# Altium schematic sheet Ganhuangguan.SchDoc
size A4
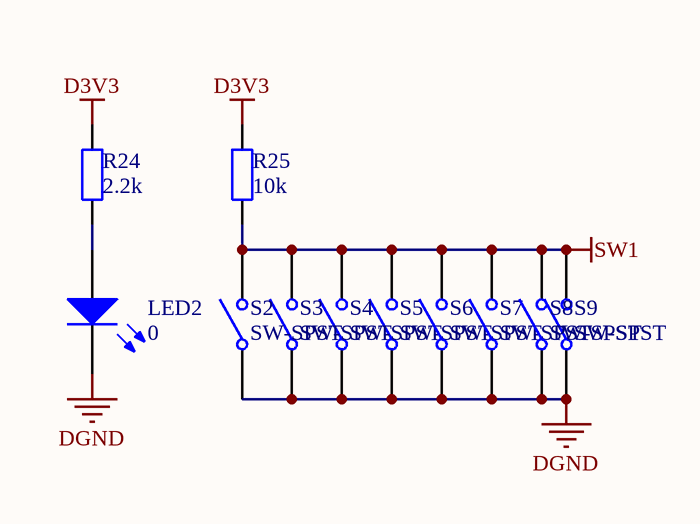
[diagram p0: Ganhuangguan.SchDoc]

## Parts
LED2  0  [0603C]
R24  value 2.2k  [0603R]  (hidden comment: Res2)
R25  value 10k  [0603C]  (hidden comment: Res2)
S2  SW-SPST  [SW_REED]
S3  SW-SPST  [SW_REED]
S4  SW-SPST  [SW_REED]
S5  SW-SPST  [SW_REED]
S6  SW-SPST  [SW_REED]
S7  SW-SPST  [SW_REED]
S8  SW-SPST  [SW_REED]
S9  SW-SPST  [SW_REED]

## Nets
D3V3: R24.2 R25.2
DGND: LED2.2(K) S2.1(COMMON) S3.1(COMMON) S4.1(COMMON) S5.1(COMMON) S6.1(COMMON) S7.1(COMMON) S8.1(COMMON) S9.1(COMMON)
SW1: R25.1 S2.2(NO) S3.2(NO) S4.2(NO) S5.2(NO) S6.2(NO) S7.2(NO) S8.2(NO) S9.2(NO)
NetLED2_1: LED2.1(A) R24.1

## Library data of the parts
LED2 = LED2: Typical RED, GREEN, YELLOW, AMBER GaAs LED; Published: 8-Jun-2000; LatestRevisionDate: 17-Jul-2002; LatestRevisionNote: Re-released for DXP Platform.; PackageVersion: Feb-2002; PackageReference: 3.2X1.6X1.1; Publisher: Altium Limited; PackageDescription: SM LED; 2 Flat Leads
R24 R25 = Res2: Resistor; Published: 8-Jun-2000; LatestRevisionDate: 17-Jul-2002; LatestRevisionNote: Re-released for DXP Platform.; PackageReference: AXIAL-0.4; Publisher: Altium Limited; PackageDescription: Axial Device, Thru-Hole; 2 Leads; 0.4 in Pin Spacing
S2-S9 = SW-SPST: Single-Pole, Single-Throw Switch; Published: 24-Mar-1999; LatestRevisionDate: 17-Jul-2002; LatestRevisionNote: Re-released for DXP Platform.; PackageReference: SPST-2; Publisher: Altium Limited; PackageDescription: Switch; 2 Leads